# EAGLE design OSD_PCB (EAGLE 9.2.0)
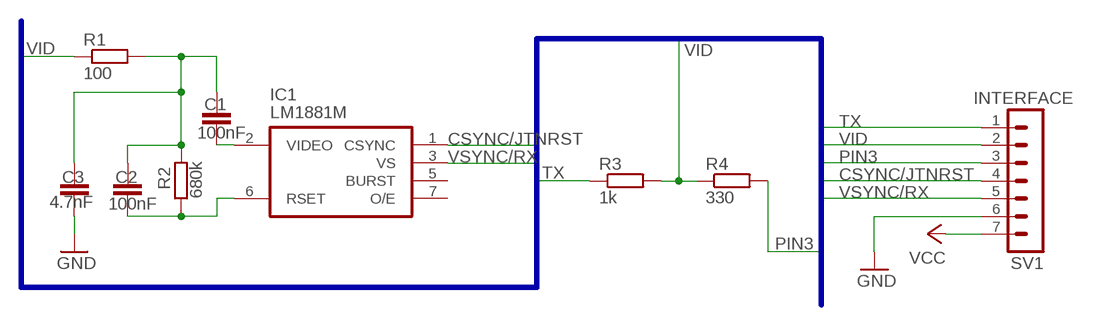
[diagram p0: schematic, sheet 1]

## Parts
C1  100nF  C-EUC0603  [C0603]
C2  100nF  C-EUC0603  [C0603]
C3  4.7nF  C-EUC0603  [C0603]
IC1  LM1881M  [SO08]
R1  100  R-EU_R0603  [R0603]
R2  680k  R-EU_R0603  [R0603]
R3  1k  R-EU_R0603  [R0603]
R4  330  R-EU_R0603  [R0603]
SV1  INTERFACE  MA07-1  [MA07-1]

## Nets
CSYNC/JTNRST: IC1.1(CSYNC) SV1.4
GND: C3.2 SV1.6
N$1: C1.2 IC1.2(VIDEO)
N$2: C2.2 IC1.6(RSET) R2.1
N$3: C1.1 C2.1 C3.1 R1.2 R2.2
PIN3: R4.2 SV1.3
TX: R3.1 SV1.1
VCC: SV1.7
VID: R1.1 R3.2 R4.1 SV1.2
VSYNC/RX: IC1.3(VS) SV1.5
Unconnected: IC1.5(BURST) IC1.7(O/E)

## Buses
CSYNC/JTNRST,PIN3,TX,VID,VSYNC/RX

## Power pins joined to a net without a drawn wire
GND: IC1.4(GND)
VCC: IC1.8(VCC)

## Library data of the parts
C1-C3 = resistor:C-EU: CAPACITOR, European symbol
IC1 = oldchips2:LM1881: Video sync separator
R1-R4 = resistor:R-EU_: RESISTOR, European symbol
SV1 = con-lstb2:MA07-1: PIN HEADER; OC_FARNELL: unknown; OC_NEWARK: unknown; SPICEPREFIX: X

## Net classes
0 default: width 0.4 mm, drill 0.3 mm, clearance 0.2 mm

## Board
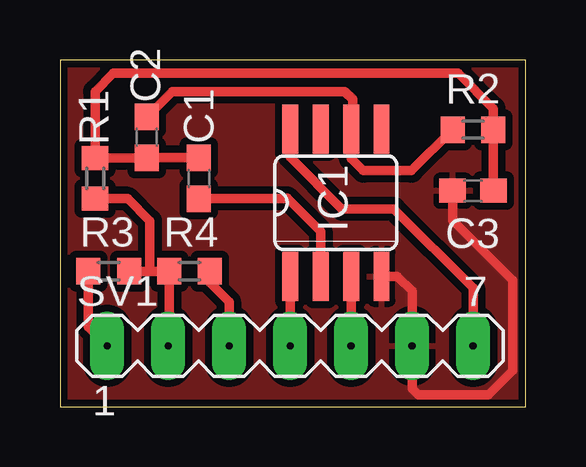
[diagram p1: board, top side]

Size 19.41 x 14.47 mm. Coordinates in mm from the lower left corner, seen from the top.
Outline: 0,0 19.41,0 19.41,14.47 0,14.47 0,0
Copper layers (1*16): Top 0.035mm / dielectric 1mm / Bottom 0.035mm
Design rules "default *": minimum track width 0.4mm, minimum drill 0.3mm, track to track 0.3mm, track to pad 0.3mm, pad to pad 0.3mm, via to via 0.3mm, smd to smd 0.3mm, copper to edge 0.3mm, drill to drill 0.3mm, minimum pad ring 10mil, minimum via ring 8mil, stop-mask expansion 4mil, vias tented up to drill 0mil, thermal gap 10mil

### Footprints (pad centres in the part's own frame; a part is rotated, then mirrored left to right if it is on the bottom)
C0603 = smd 1.1 x 1: 1 -0.85,0; 2 0.85,0
SO08 = smd 0.66 x 2.032: 1 -1.905,-3.073; 2 -0.635,-3.073; 3 0.635,-3.073; 4 1.905,-3.073; 5 1.905,3.073; 6 0.635,3.073; 7 -0.635,3.073; 8 -1.905,3.073
R0603 = smd 1 x 1.1: 1 -0.85,0; 2 0.85,0
MA07-1 = drill 0.3 pad 1.422 long: 1 -7.62,0; 2 -5.08,0; 3 -2.54,0; 4 0,0; 5 2.54,0; 6 5.08,0; 7 7.62,0

### Placement (x,y rotation side)
C1  5.78,9.52 270 top
C2  3.62,11.24 90 top
C3  17.21,9.02 180 top
IC1  11.49,8.51 0 top
R1  1.46,9.52 90 top
R2  17.21,11.56 0 top
R3  2.03,5.65 0 top
R4  5.4,5.65 0 top
SV1  9.59,2.54 0 top

### Tracks (layer width: path | path; a pad name or v marks a point on that pad's centre or on a via)
CSYNC/JTNRST
  Top 0.4: IC1.1 SV1.4
GND
  Top 0.4: C3.2 16.36,7.77 18.86,5.27 18.86,1.52 17.84,0.5 14.92,0.5 14.67,0.75 SV1.6 14.67,4.83 14.06,5.44 IC1.4
  pour Top (isolate 0.3): 0,14.48 19.43,14.48 19.43,0 0,0
N$1
  Top 0.4: IC1.2 10.86,7.3 9.46,8.7 9.44,8.67 C1.2
N$2
  Top 0.4: R2.1 14.64,9.84 12.64,9.84 12.13,10.35 IC1.6 12.19,11.65 12.19,12.83 11.87,13.14 4.67,13.14 C2.2
N$3
  Top 0.4: C3.1 R2.2 18.06,12.44 16.59,13.91 2.22,13.91 1.46,13.14 R1.2 3.61,10.38 C2.1 5.77,10.39 C1.1
PIN3
  Top 0.4: R4.2 6.25,5.18 7.05,4.38 SV1.3
TX
  Top 0.4: R3.1 1.18,3.33 SV1.1
VCC
  Top 0.4: IC1.8 9.59,10.41 11.75,8.25 13.91,8.25 17.21,4.95 SV1.7
VID
  Top 0.4: 3.75,5.65 R3.2 | 3.75,5.65 R4.1 4.55,2.58 SV1.2 | R1.1 2.82,8.67 3.75,7.75 3.75,5.65
VSYNC/RX
  Top 0.4: IC1.3 SV1.5